# Altium schematic sheet SPSGRFSheet.SchDoc
size A
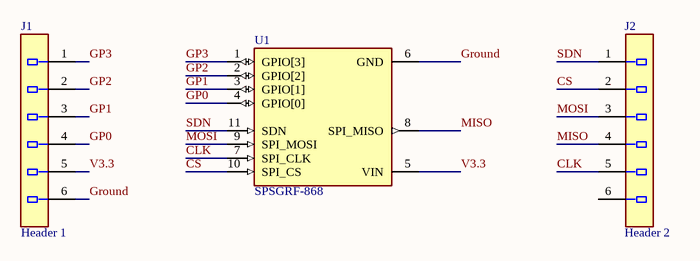
[diagram p0: SPSGRFSheet.SchDoc]

## Parts
J1  Part Number: Header 1  [TE_C-826629_0]  (hidden comment: Conn_TE_826629-6_eec)
J2  Part Number: Header 2  [TE_C-826629_0]  (hidden comment: Conn_TE_826629-6_eec)
U1  SPSGRF-868  [XCVR_SPSGRF-868]

## Nets
CLK: J2.5 U1.7(SPI_CLK)
CS: J2.2 U1.10(SPI_CS)
GP0: J1.4 U1.4(GPIO[0])
GP1: J1.3 U1.3(GPIO[1])
GP2: J1.2 U1.2(GPIO[2])
GP3: J1.1 U1.1(GPIO[3])
Ground: J1.6 U1.6(GND)
MISO: J2.4 U1.8(SPI_MISO)
MOSI: J2.3 U1.9(SPI_MOSI)
SDN: J2.1 U1.11(SDN)
V3.3: J1.5 U1.5(VIN)

Not connected (* = marked no-connect by the designer): J2 6

## Library data of the parts
J1 J2 = Conn_TE_826629-6_eec: CONN HEADER BRKWAWAY 6POS AU; Manufacturer: TE; Mfg Package Ident: C-826629; Symbol 0 0: Standard; Num Pins: 6; helpURL: https://upverter.com/upn/revision/017f1bdfe55378c0/; ComponentLink2Description: Datasheet; Temperature: to; Package: C-826629; Supplier 2: Mouser; Price: 0.393365307724; Supplier 1: Digi-Key; ComponentLink1URL: https://upverter.com/upn/revision/017f1bdfe55378c0/; Supplier Part Number 2: 571-826629-6; Supplier Part Number 1: A121495-ND; ComponentLink1Description: Upverter; ComponentLink2URL: http://www.te.com/commerce/DocumentDelivery/DDEController?Action=srchrtrv&DocNm=826629&DocType=Customer+Drawing&DocLang=English&DocFormat=pdf&PartCntxt=826629-6; RoHS: TRUE; Mouser Part Number: 571-826629-6; Ipc Land Pattern Name: SIP250W63P254L1524H711Q6; Digikey Description: CONN HEADER BRKWAWAY 6POS AU; Digikey Part Number: A121495-ND; Type: integrated circuit; Lead Free: yes
U1 = SPSGRF-868: MÃ³dulo transceptor general ISM <1 GHz 868 MHz integrado, montaje en superficie de chip; MF: STMicroelectronics; Package: Module STMicroelectronics; MP: SPSGRF-868; Value: *; Purchase-URL: https://pricing.snapeda.com/search/part/SPSGRF-868/?ref=eda; Availability: Good; Price: None; SnapEDA_Link: https://www.snapeda.com/parts/SPSGRF-868/STMicroelectronics/view-part/478626/?ref=snap